# Altium schematic sheet AUDIO.SchDoc: =DocumentName
size B
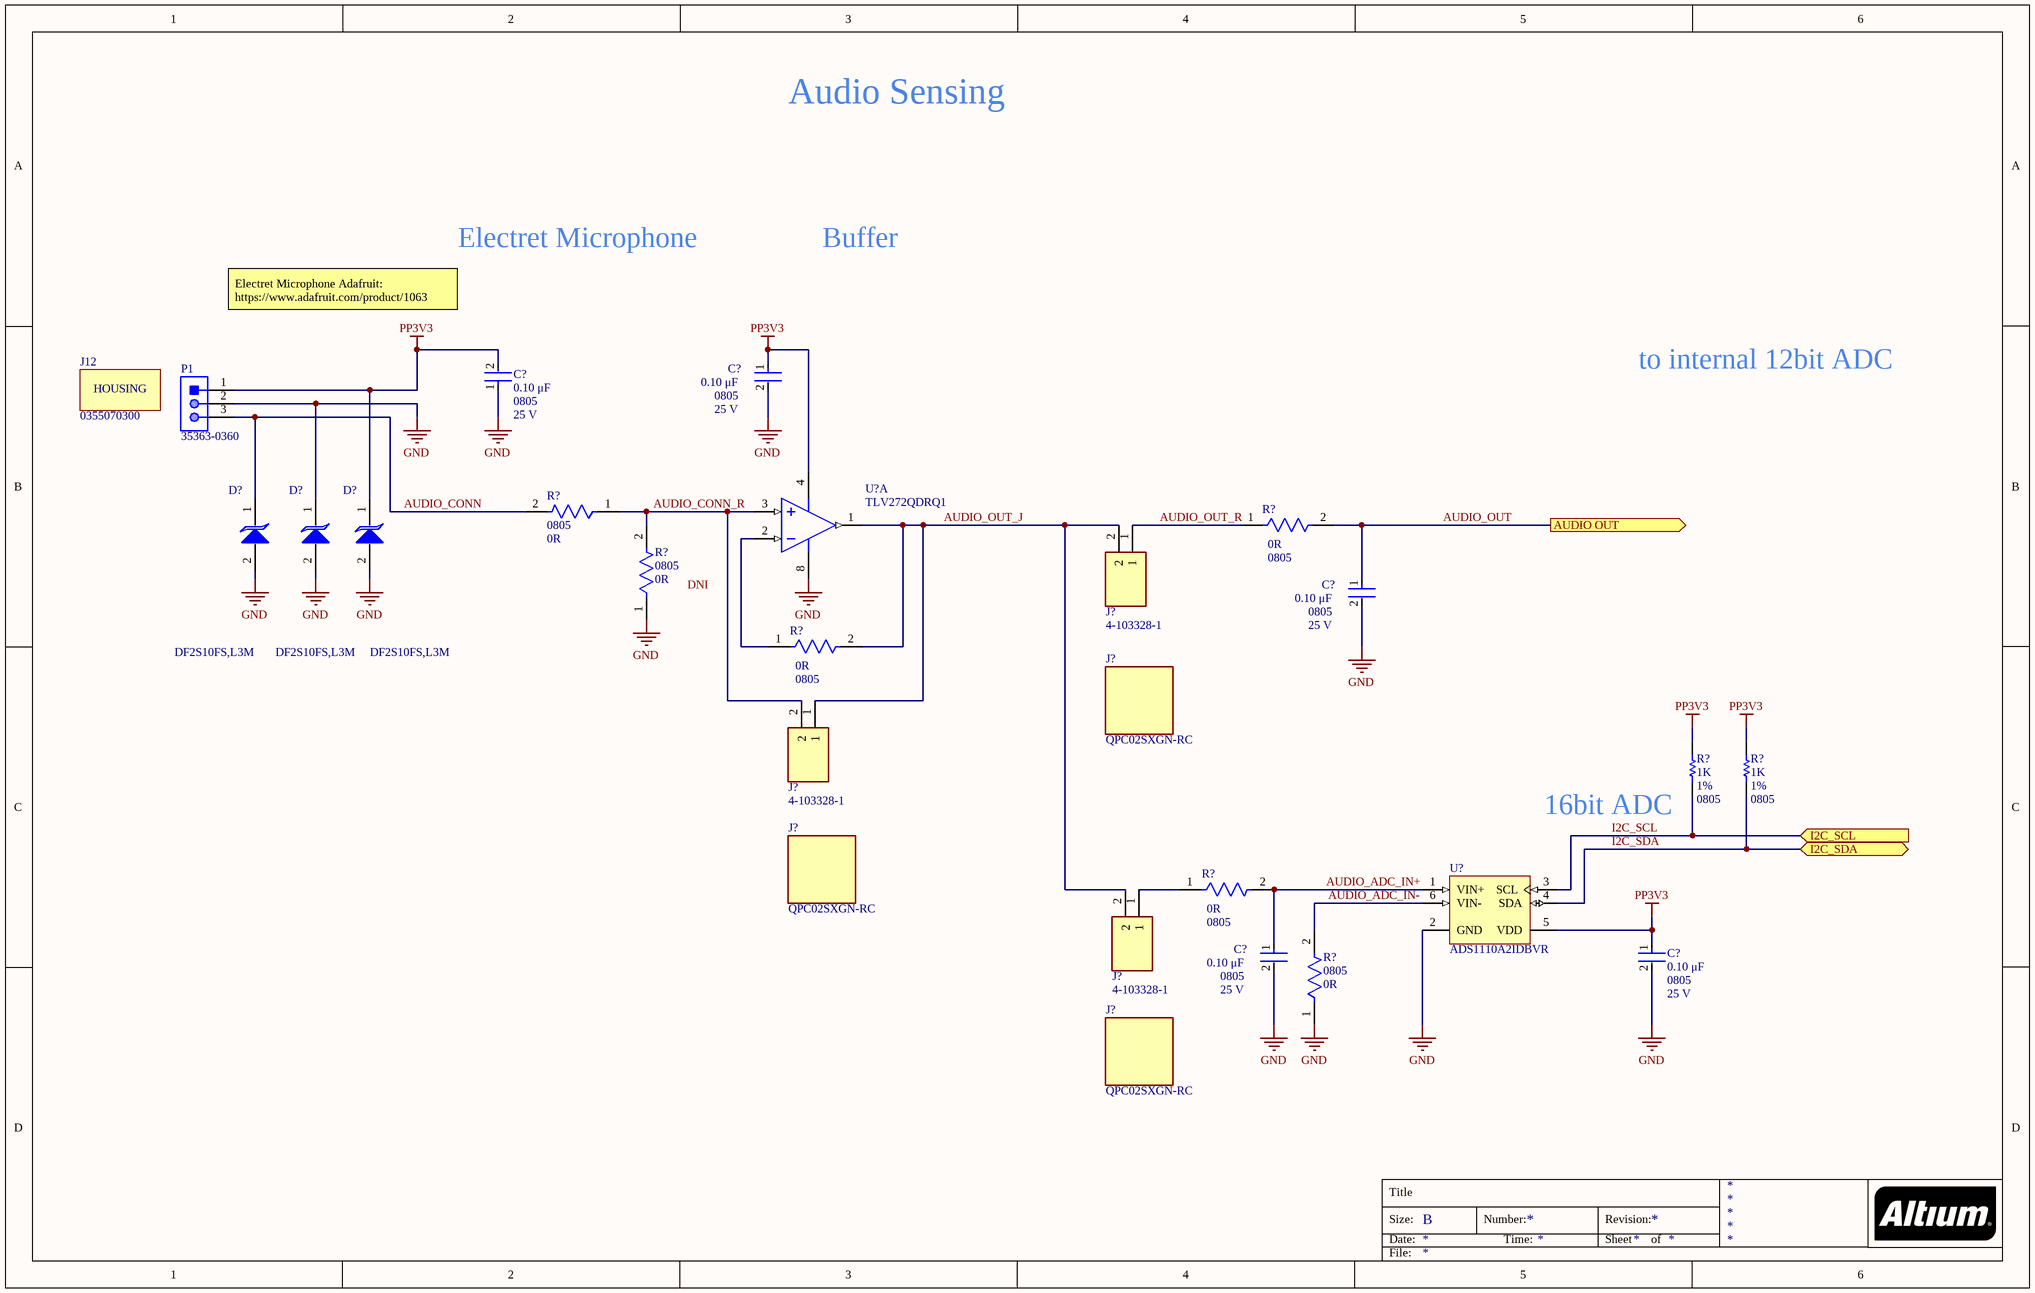
[diagram p0: AUDIO.SchDoc]

## Parts
(Parts that share a designator on the sheet are numbered #1, #2 ... from top to bottom, then left to right.)
C?#1  Capacitance: 0.10 μF  Package: 0805  Voltage Rating: 25 V  [FP-C0805C-DN-MFG]  (hidden comment: C0805C104M3RACTU)
C?#2  Capacitance: 0.10 μF  Package: 0805  Voltage Rating: 25 V  [FP-C0805C-DN-MFG]  (hidden comment: C0805C104M3RACTU)
C?#3  Capacitance: 0.10 μF  Package: 0805  Voltage Rating: 25 V  [FP-C0805C-DN-MFG]  (hidden comment: C0805C104M3RACTU)
C?#4  Capacitance: 0.10 μF  Package: 0805  Voltage Rating: 25 V  [FP-C0805C-DN-MFG]  (hidden comment: C0805C104M3RACTU)
C?#5  Capacitance: 0.10 μF  Package: 0805  Voltage Rating: 25 V  [FP-C0805C-DN-MFG]  (hidden comment: C0805C104M3RACTU)
D?#1  DF2S10FS,L3M  [DIOM106X45N]
D?#2  DF2S10FS,L3M  [DIOM106X45N]
D?#3  DF2S10FS,L3M  [DIOM106X45N]
J12  0355070300
J?#1  4-103328-1  [TE_4-103328-1]
J?#2  QPC02SXGN-RC  [FP-QPC02SXGN-RC-MFG]
J?#3  4-103328-1  [TE_4-103328-1]
J?#4  QPC02SXGN-RC  [FP-QPC02SXGN-RC-MFG]
J?#5  4-103328-1  [TE_4-103328-1]
J?#6  QPC02SXGN-RC  [FP-QPC02SXGN-RC-MFG]
P1  35363-0360  [MOLX-35363-0360_V]
R?#1  Case/Package: 0805  Resistance: 0R  [FP-RMCF0805-MFG]  (hidden comment: RMCF0805ZT0R00)
R?#2  Case/Package: 0805  Resistance: 0R  [FP-RMCF0805-MFG]  (hidden comment: RMCF0805ZT0R00)
R?#3  Case/Package: 0805  Resistance: 0R  [FP-RMCF0805-MFG]  (hidden comment: RMCF0805ZT0R00)
R?#4  Case/Package: 0805  Resistance: 0R  [FP-RMCF0805-MFG]  (hidden comment: RMCF0805ZT0R00)
R?#5  Resistance: 1K  Tolerance: 1%  Case Code (Imperial): 0805  [RESC2013X60X35ML10T20]  (hidden comment: RC0805FR-071KL)
R?#6  Resistance: 1K  Tolerance: 1%  Case Code (Imperial): 0805  [RESC2013X60X35ML10T20]  (hidden comment: RC0805FR-071KL)
R?#7  Case/Package: 0805  Resistance: 0R  [FP-RMCF0805-MFG]  (hidden comment: RMCF0805ZT0R00)
R?#8  Case/Package: 0805  Resistance: 0R  [FP-RMCF0805-MFG]  (hidden comment: RMCF0805ZT0R00)
U?#1  TLV272QDRQ1  [D0008A_N]  (part A of 2)
U?#2  ADS1110A2IDBVR  [TI-DBV6_M]

## Ports
AUDIO OUT (out), I2C_SCL (in), I2C_SDA (bidir)

## Nets
GND: C?#1.2 C?#2.1 C?#3.2 C?#4.2 C?#5.2 D?#1.2(A) D?#2.1(K) D?#2.2(A) D?#3.2(A) P1.2 R?#3.1 R?#8.1 U?#1.8(VDD) U?#2.2(GND)
PP3V3: C?#1.1 C?#2.2 C?#5.1 D?#3.1(K) P1.1 R?#5.2 R?#6.2 U?#1.4(GND) U?#2.5(VDD)
AUDIO_ADC_IN+: C?#4.1 R?#7.2 U?#2.1(VIN+)
AUDIO_ADC_IN-: R?#8.2 U?#2.6(VIN-)
AUDIO_CONN: D?#1.1(K) P1.3 R?#1.2
AUDIO_CONN_R: J?#3.2 R?#1.1 R?#3.2 U?#1.3(IN1+)
AUDIO_OUT: C?#3.1 R?#2.2 ; port AUDIO OUT
AUDIO_OUT_J: J?#1.2 J?#3.1 J?#5.2 R?#4.2 U?#1.1(OUT1)
AUDIO_OUT_R: J?#1.1 R?#2.1
I2C_SCL: R?#5.1 U?#2.3(SCL) ; port I2C_SCL
I2C_SDA: R?#6.1 U?#2.4(SDA) ; port I2C_SDA
NetJ?#5_1: J?#5.1 R?#7.1
NetR?#4_1: R?#4.1 U?#1.2(IN1-)

## Notes on the sheet
- Audio Sensing
- Electret Microphone
- Buffer
- Electret Microphone Adafruit: https://www.adafruit.com/product/1063
- to internal 12bit ADC
- (near R?#3) DNI
- 16bit ADC
- Title
- Size:
- Date:
- B
- Number:
- Time:
- Revision:
- Sheet
- of
- File:
- (in symbol 0355070300) HOUSING

## Library data of the parts
C?#1-C?#5 = CMP-2007-00282-2: CAP CER 0.1UF 25V 20% X7R 0805; Manufacturer: KEMET; Temperature Coefficient: 30ppm/°C; Material: Ceramic; Tolerance: 0.2; Value: 0.10 μF; Digikey Description: CAP CER 0.1UF 25V 20% X7R 0805; Device Class L2: Capacitors; Temperature: -55°C to +125°C; Device Class L1: Passive Components; ComponentLink2Description: Datasheet; Mouser Description: Multilayer Ceramic Capacitors MLCC - SMD/SMT 25volts 0.1uF X7R 20%; Temperature Range High: +125°C; Device Class L3: Ceramic Capacitors; Automotive: No; Temperature Range Low: -55°C; RoHS: TRUE; Category: Cap; Lead Free: Yes; Ipc Land Pattern Name: CAPC200125X78; Height: 0.88mm; Temperature Characteristic: X7R; Octopart: https://octopart.com/c0805c104m3ractu-kemet-9138612; ComponentLink2URL: https://content.kemet.com/datasheets/KEM_C1003_C0G_SMD.pdf; Manufacturer Part Number: C0805C104M3RACTU; Supplier: Digi-Key; Supplier Part Number: 399-C0805C104M3RAC7800CT-ND
D?#1-D?#3 = DF2S10FS,L3M: TVS DIODE 8VWM FSC; Manufacturer_Name: Toshiba; Manufacturer: Toshiba Semiconductor and Storage; Datasheet Link: https://componentsearchengine.com/Datasheets/1/DF2S10FS,L3M.pdf; Height: 0.45mm; Manufacturer_Part_Number: DF2S10FS,L3M; Mouser Part Number: 757-DF2S10FSL3M; Mouser Price/Stock: https://www.mouser.co.uk/ProductDetail/Toshiba/DF2S10FSL3M?qs=lhkzy8lC%252BSsM5fAm2E7mCQ%3D%3D; Arrow Part Number: DF2S10FS,L3M; Arrow Price/Stock: https://www.arrow.com/en/products/df2s10fsl3m/toshiba?region=nac; Manufacturer Part Number: DF2S10FS,L3M; Supplier: Digi-Key; Supplier Part Number: DF2S10FSL3MCT-ND
J12 = 0355070300: Manufacturer: Molex; Manufacturer Part Number: 0355070300; Supplier: Digi-Key; Supplier Part Number: WM5982-ND
J?#1 J?#3 J?#5 = 4-103328-1: Connector Header Through Hole 2 position; Manufacturer: TE Connectivity AMP Connectors; MF: TE Connectivity; SnapEDA_Link: https://www.snapeda.com/parts/4-103328-1/TE%20Connectivity%20AMP%20Connectors/view-part/2384420/?ref=snap; MP: 4-103328-1; TE_purchase_URL: https://www.te.com/usa-en/product-4-103328-1.html?te_bu=Cor&te_type=disp&te_campaign=seda_glo_cor-seda-global-disp-prtnr-fy19-seda-model-bom-cta_sma-317_1&elqCampaignId=32493; Availability: Unavailable; Value: *; EU_RoHS_Compliance: Compliant; Price: None; Package: None; Supplier: Digi-Key; Supplier Part Number: A121364-ND; Manufacturer Part Number: 4-103328-1
J?#2 J?#4 J?#6 = CMP-25666-000001-1: CONN JUMPER SHORTING .100" GOLD; Manufacturer: Sullins; Conn Orientation: Straight; Pitch: 2.54mm; Current Rating: 3A; Number Of Contacts: 2; Category: Conn; Temperature Range Low: -40°C; Temperature Range High: +85°C; Device Class L1: Connectors; Lead Free: Yes; Manufacturer Part Number: QPC02SXGN-RC; Automotive: No; Height: 6.17mm; ComponentLink2URL: https://s3.amazonaws.com/catalogspreads-pdf/PAGE128-129%20.100%20JUMPER.pdf; Device Class L2: unset; Footprint Url: https://drawings-pdf.s3.amazonaws.com/11510.pdf; Device Class L3: unset; Temperature: -40°C to +85°C; RoHS: TRUE; Digikey Description: CONN JUMPER SHORTING .100" GOLD; Octopart: https://octopart.com/qpc02sxgn-rc-sullins-19878795; Package: 0; ComponentLink2Description: Datasheet; Contact Material: Gold; Supplier: Digi-Key; Supplier Part Number: S9337-ND
P1 = CMP-2000-05595-1: Male Header, Pitch 2 mm, 1 x 3 Position, Height 5.5 mm, Tail Length 3.2 mm, -40 to 105 degC, RoHS, Bulk; Manufacturer: Molex; Manufacturer Part Number: 0353630360; Gender: HDR; Pitch: 2mm; Number of Contacts: 3; Datasheet Version: Rev. G, 01/2012; Package Description: Male Header, Pitch 2 mm, 1 x 3 Position, Height 5.5 mm, Tail Length 3.2 mm; Datasheet URL: http://www.molex.com/pdm_docs/sd/353630360_sd.pdf; Termination Method: Solder; Category: ConnectorHeadersandPCBReceptacles; Number of Rows: 1; Manufacturer URL: http://www.molex.com/; Type: WiretoBoard; Mounting Technology: ThroughHole; Package Reference: 35363-0360; Supplier: Digi-Key; Supplier Part Number: WM18932-ND
R?#1-R?#4 R?#7 R?#8 = CMP-26527-000017-1: RES 0 OHM JUMPER 1/8W 0805; Manufacturer: Stackpole Electronics Inc; Power Rating: 125mW; Depth: 1.25mm; Length: 2mm; Military Standard: Not; Width: 0.049inch; Case Code (Imperial): 0805; Number of Terminations: 2; Mount: Surface Mount; Contact Plating: Tin; Height: 0.026inch; Min Operating Temperature: -55°C; Composition: Thick Film; Max Operating Temperature: 155°C; Packaging: Tape and Reel; Features: Automotive AEC-Q200; Max Power Dissipation: 125mW; Radiation Hardening: No; Lead Free: Lead Free; Case Code (Metric): 2012; Supplier: Digi-Key; Supplier Part Number: RMCF0805ZT0R00CT-ND; Manufacturer Part Number: RMCF0805ZT0R00
R?#5 R?#6 = CMP-2100-03671-1: Chip Resistor, 1 KOhm, +/- 1%, 125 mW, -55 to 155 degC, 0805 (2012 Metric), RoHS, Tape and Reel; Manufacturer: Yageo; Temperature Coefficient: 100ppm/degreesC; Voltage Rating (DC): 150V; Max Power Dissipation: 125mW; Number of Pins: 2; Number of Terminations: 2; Datasheet URL: http://www.yageo.com/NewPortal/yageodocoutput?fileName=/pdf/R-Chip/PYu-RC_Group_51_RoHS_L_5.pdf; Length: 0.079inch; Package Description: 2-Pin Surface Mounted Device, Body 2 x 1.25 mm; Depth: 1.25mm; Height: 0.024inch; Military Standard: Not; Case/Package: 0805; Package Reference: 0805; RoHSCompliant: true; Lead Free: LeadFree; Packaging: TapeandReel; Package Quantity: 1; Datasheet Version: Rev. 5, 10/2016; Min Operating Temperature: -55degC; Voltage Rating: 150V; Composition: ThickFilm; Power Rating: 125mW; Width: 0.049inch; Case Code (Metric): 2012; Manufacturer URL: http://www.yageo.com/; Max Operating Temperature: 155degC; REACH SVHC: Unknown; Termination: SMD/SMT; Manufacturer Part Number: RC0805FR-071KL; Supplier: Digi-Key; Supplier Part Number: 311-1.00KCRCT-ND
U?#1 = CMP-0272-02933-3: Automotive Catalog 550 uA/Ch, 3 MHz, Rail-to-Rail Output Operational Amplifier, 2.7 to 16 V, -40 to 125 degC, 8-pin SOIC (D8), Green (RoHS & no Sb/Br); Manufacturer: Texas Instruments; IIB(Max)(pA): 60; Packing: LARGE T&R; Number of Channels: 2; GBW(Typ)(MHz): 3; Iq per channel(Max)(mA): 0.66; Slew Rate(Typ)(V/us): 2.4; Total Supply Voltage(Max)(+5V is 5, +/-5V is 10): 16; CMRR(Min)(dB): 58; Total Supply Voltage(Min)(+5V is 5, +/-5V is 10): 2.7; Sub Family: Low Supply Voltage Amplifier (<=2.7V), Precision Amplifier; Vio (25C)(Max)(mV): 5; PackageReference: D0008A; ComponentLink2URL: http://www.ti.com/lit/ds/symlink/tlv272-q1.pdf; ComponentLink1Description: Manufacturer URL; Mounting Technology: Surface Mount; DatasheetVersion: SGLS275A; PartNumber: TLV272QDRQ1; ComponentLink2Description: Datasheet; Offset Drift(Typ)(uV/C): 2; PackageVersion: 4040047-3/M, 06/2011; Rating: Automotive; ComponentLink1URL: http://www.ti.com/; Code_JEDEC: MS-012; ComponentLink3Description: Package Specification; ComponentLink3URL: http://www.ti.com/litv/pdf/msoi002j; PackageDescription: 8-Pin Plastic Small Outline, Body 4.9 x 3.9 mm, Pitch 1.27 mm; Eco-Plan: Green (RoHS & no Sb/Br); Manufacturer Part Number: TLV272QDRQ1; Supplier: Digi-Key; Supplier Part Number: 296-17870-1-ND
U?#2 = CMP-0003-00278-2: 16-Bit Delta-Sigma ADC with Internal Reference, PGA and Oscillator, I2C Serial Interface, -40 to 85 degC, 6-pin SOT23 (DBV6), Green (RoHS & no Sb/Br); Manufacturer: Texas Instruments; SubFamily: Precision ADC (<=10MSPS); # Input Channels: 1; Interface: Serial I2C; Digital Supply(Min)(V): 2.7; Resolution(Bits): 16; Digital Supply(Max)(V): 5.5; Sample Rate (max)(SPS): 240; ComponentLink2Description: Datasheet; PackageDescription: 6-Pin Plastic Small Outline, Body 1.6 x 2.9 mm, Pitch 0.95 mm; PackageReference: DBV6; ComponentLink1Description: Manufacturer URL; ComponentLink1URL: http://www.ti.com/; Analog Voltage AV/DD(Min)(V): 2.7; ComponentLink3Description: Package Specification; Mounting Technology: Surface Mount; DatasheetVersion: SBAS276A; PackageVersion: 4073253-5/K, 03/2006; Eco-Plan: Green (RoHS & no Sb/Br); Code_JEDEC: MO-178; PartNumber: ADS1110A2IDBVR; ComponentLink2URL: http://www.ti.com/general/docs/lit/getliterature.tsp?genericPartNumber=ADS1110&fileType=pdf; Architecture: Delta-Sigma; ComponentLink3URL: http://www.ti.com/litv/pdf/mpds026h; Analog Voltage AV/DD(Max)(V): 5.5